# Altium schematic sheet Stepper Driver With DRV8825.SchDoc
size A4
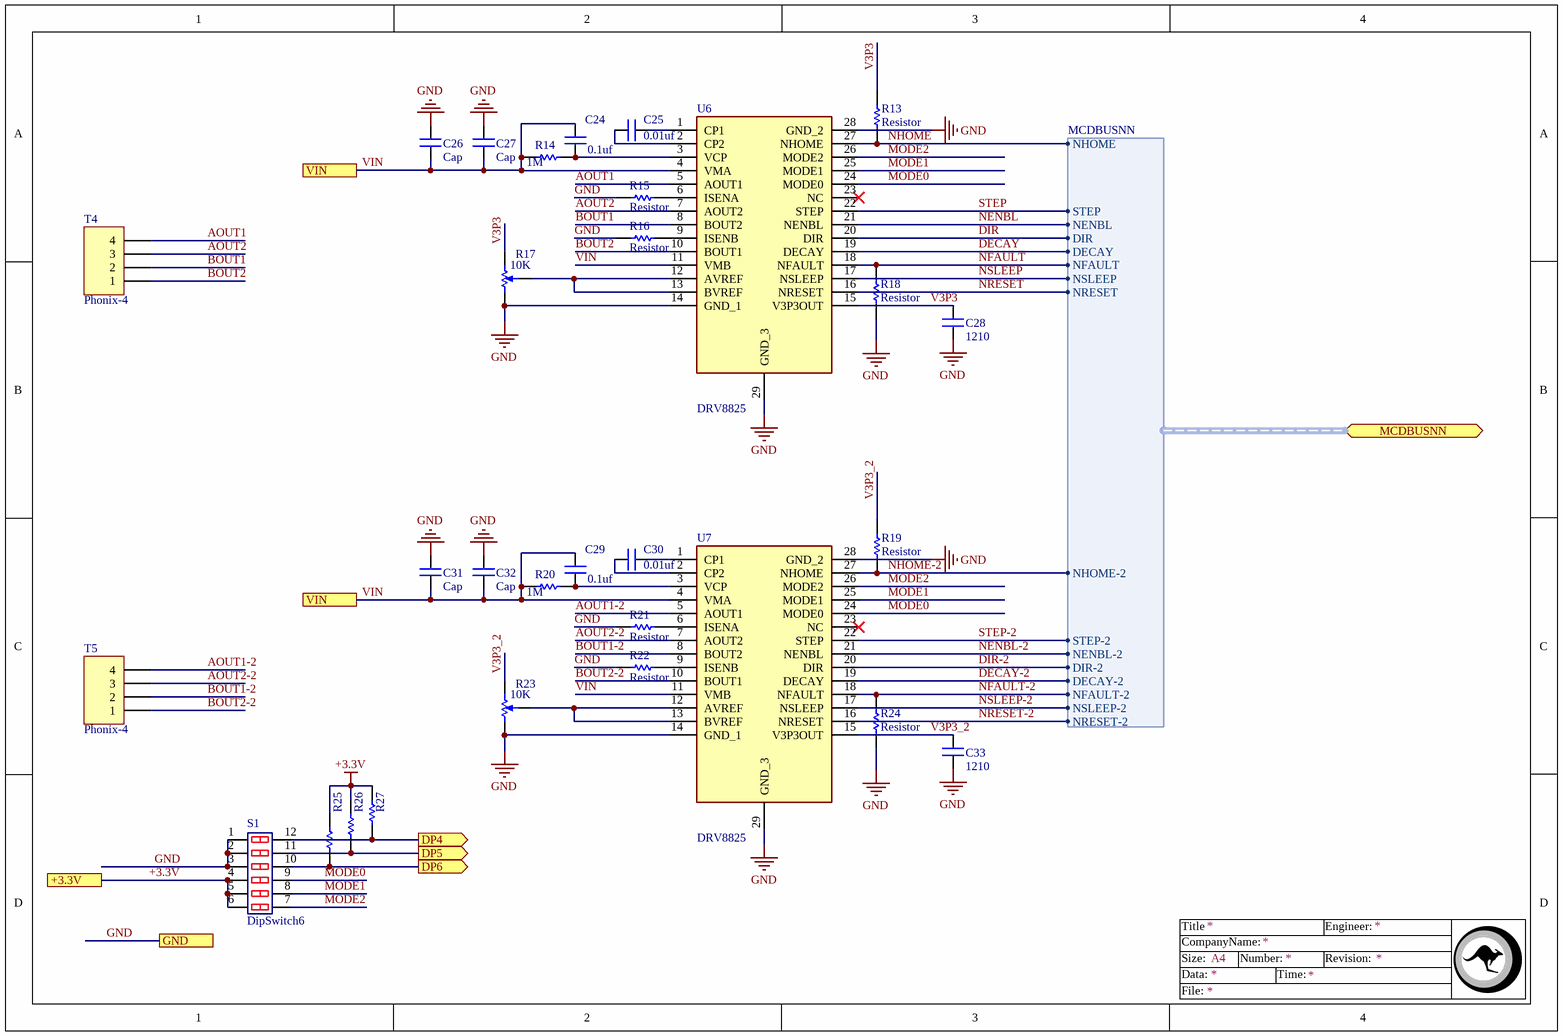
[diagram p0: Stepper Driver With DRV8825.SchDoc]

## Parts
C24  0.1uf  [Cap0805]
C25  0.01uf  [Cap0805]
C26  Cap  [Cap0805]
C27  Cap  [Cap0805]
C28  1210  [CAP1206]
C29  0.1uf  [Cap0805]
C30  0.01uf  [Cap0805]
C31  Cap  [Cap0805]
C32  Cap  [Cap0805]
C33  1210  [CAP1206]
R13  Resistor  [R0805]
R14  1M  [R0805]
R15  Resistor  [R0805]
R16  Resistor  [R0805]
R17  value 10K  [POT4MM-Small Pot]  (hidden comment: RPot SM)
R18  Resistor  [R0805]
R19  Resistor  [R0805]
R20  1M  [R0805]
R21  Resistor  [R0805]
R22  Resistor  [R0805]
R23  value 10K  [POT4MM-Small Pot]  (hidden comment: RPot SM)
R24  Resistor  [R0805]
R25  Resistor  [R0805]  (value not drawn)
R26  Resistor  [R0805]  (value not drawn)
R27  Resistor  [R0805]  (value not drawn)
S1  DipSwitch6  [DIPSW6]
T4  Phonix-4  [Phonix-4]
T5  Phonix-4  [Phonix-4]
U6  DRV8825  [SOP65P640X120-29N]
U7  DRV8825  [SOP65P640X120-29N]

## Ports
+3.3V, DP4 (out), DP5 (out), DP6 (out), GND, MCDBUSNN (bidir, harness MCDBUSNN), VIN

## Harnesses
MCDBUSNN: NHOME, STEP, NENBL, DIR, DECAY, NFAULT, NSLEEP, NRESET, NHOME-2, STEP-2, NENBL-2, DIR-2, DECAY-2, NFAULT-2, NSLEEP-2, NRESET-2

## Nets
+3.3V: R25.1 R26.1 R27.1 S1.4 S1.5 S1.6 ; port +3.3V
GND: C26.2 C27.2 C28.1 C31.2 C32.2 C33.1 R15.2 R16.2 R17.CCW(-) R18.2 R21.2 R22.2 R23.CCW(-) R24.2 S1.1 S1.2 S1.3 U6.14(GND_1) U6.28(GND_2) U6.29(GND_3) U7.14(GND_1) U7.28(GND_2) U7.29(GND_3) ; port GND
AOUT1: T4.4 U6.5(AOUT1)
AOUT1-2: T5.4 U7.5(AOUT1)
AOUT2: T4.3 U6.7(AOUT2)
AOUT2-2: T5.3 U7.7(AOUT2)
BOUT1: T4.2 U6.8(BOUT2)
BOUT1-2: T5.2 U7.8(BOUT2)
BOUT2: T4.1 U6.10(BOUT1)
BOUT2-2: T5.1 U7.10(BOUT1)
DECAY: U6.19(DECAY) ; port MCDBUSNN.DECAY
DECAY-2: U7.19(DECAY) ; port MCDBUSNN.DECAY-2
DIR: U6.20(DIR) ; port MCDBUSNN.DIR
DIR-2: U7.20(DIR) ; port MCDBUSNN.DIR-2
DP4: R27.2 S1.12 ; port DP4
DP5: R26.2 S1.11 ; port DP5
DP6: R25.2 S1.10 ; port DP6
MODE0: S1.9 U6.24(MODE0) U7.24(MODE0)
MODE1: S1.8 U6.25(MODE1) U7.25(MODE1)
MODE2: S1.7 U6.26(MODE2) U7.26(MODE2)
NENBL: U6.21(NENBL) ; port MCDBUSNN.NENBL
NENBL-2: U7.21(NENBL) ; port MCDBUSNN.NENBL-2
NFAULT: R18.1 U6.18(NFAULT) ; port MCDBUSNN.NFAULT
NFAULT-2: R24.1 U7.18(NFAULT) ; port MCDBUSNN.NFAULT-2
NHOME: R13.2 U6.27(NHOME) ; port MCDBUSNN.NHOME
NHOME-2: R19.2 U7.27(NHOME) ; port MCDBUSNN.NHOME-2
NRESET: U6.16(NRESET) ; port MCDBUSNN.NRESET
NRESET-2: U7.16(NRESET) ; port MCDBUSNN.NRESET-2
NSLEEP: U6.17(NSLEEP) ; port MCDBUSNN.NSLEEP
NSLEEP-2: U7.17(NSLEEP) ; port MCDBUSNN.NSLEEP-2
STEP: U6.22(STEP) ; port MCDBUSNN.STEP
STEP-2: U7.22(STEP) ; port MCDBUSNN.STEP-2
V3P3: C28.2 R13.1 R17.CW(+) U6.15(V3P3OUT)
V3P3_2: C33.2 R19.1 R23.CW(+) U7.15(V3P3OUT)
VIN: C24.2 C26.1 C27.1 C29.2 C31.1 C32.1 R14.2 R20.2 U6.4(VMA) U6.11(VMB) U7.4(VMA) U7.11(VMB) ; port VIN
NetC24_1: C24.1 R14.1 U6.3(VCP)
NetC25_1: C25.1 U6.2(CP2)
NetC25_2: C25.2 U6.1(CP1)
NetC29_1: C29.1 R20.1 U7.3(VCP)
NetC30_1: C30.1 U7.2(CP2)
NetC30_2: C30.2 U7.1(CP1)
NetR15_1: R15.1 U6.6(ISENA)
NetR16_1: R16.1 U6.9(ISENB)
NetR17_W: R17.W U6.12(AVREF) U6.13(BVREF)
NetR21_1: R21.1 U7.6(ISENA)
NetR22_1: R22.1 U7.9(ISENB)
NetR23_W: R23.W U7.12(AVREF) U7.13(BVREF)

Not connected (* = marked no-connect by the designer): U6 23(NC)*; U7 23(NC)*

## Notes on the sheet
- Title
- Size:
- Data:
- CompanyName:
- A4
- Number:
- Time:
- Revision:
- Engineer:
- File:

## Library data of the parts
C24-C33 = Cap: Surface mount Capacitor
R14 R20 = Resistor
R15 R16 = Resistor: 200 m
R17 R23 = RPot SM: Square Trimming Potentiometer; Published: 17-Dec-2003; DatasheetVersion: Oct-2003; PackageReference: POT4MM-2; Publisher: Altium Limited; PackageDescription: Square Trimming Potentiometer; ComponentLink1Description: Manufacturer Link; ComponentLink1URL: http://bourns.com/2/search.html
S1 = DipSwitch6: DipSwitch6pin
T4 T5 = Phonix-4: Connector
U6 U7 = DRV8825: Stepper Motor Driver